# Altium schematic sheet PM12_P5V5.SchDoc: FIT_PM12 board
size 420 x 297 mm; CheckedBy: G.Kasprowicz; Author: INR Moscow; CompanyName: WUT ISE; DrawnBy: M.Podgórski; Organization: WUT ISE; Address1: PW ISE; Address2: Nowowiejska 15/19 00-665 Warsaw; Address3: gkasprow@gmail.com; DocumentNumber: 18; Revision: 2; SheetNumber: 19; SheetTotal: 34; ModifiedBy: -; CheckedDate: -; Title2: P5V5 PSU; DivGrp: WUT ISE; Designer: INR RAS; ModifiedDate: -; ProjectName: Sensor Box
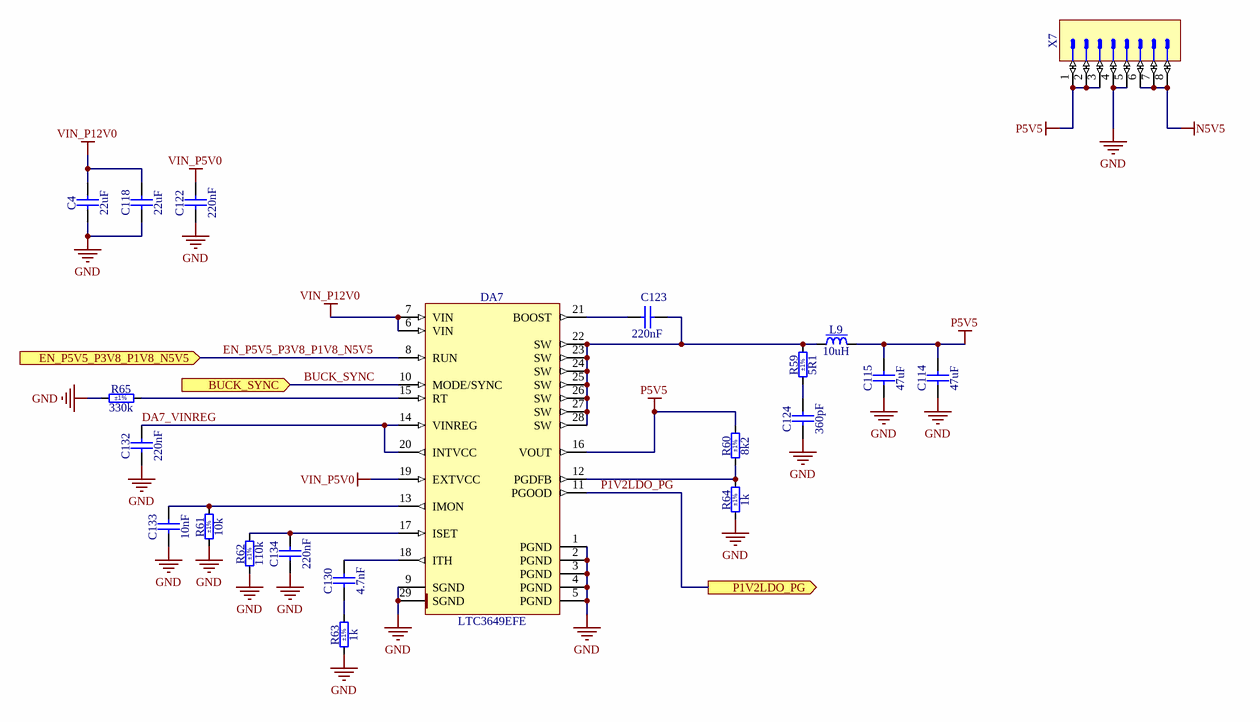
[diagram p0: PM12_P5V5.SchDoc]

## Parts
C4  22uF  [CAPC3216X180N]
C114  47uF  [CAPC3225X270N]
C115  47uF  [CAPC3225X270N]
C118  22uF  [CAPC3216X180N]
C122  220nF  [CAPC2012X135N]
C123  220nF  [CAPC2012X135N]
C124  360pF  [CAPC2013X145N]
C130  4.7nF  [CAPC2012X135N]
C132  220nF  [CAPC2012X135N]
C133  10nF  [CAPC2012X135N]
C134  220nF  [CAPC2012X135N]
DA7  LTC3649EFE  [SOP65P640X120-29N-R274X475]
L9  10uH  [IND_VISHAY_IHPL4040DZ-01]
R59  5R1  Tolerance: ±1%  [RESC2012X60N]
R60  8k2  Tolerance: ±1%  [RESC2012X60N]
R61  10k  Tolerance: ±1%  [RESC2012X60N]
R62  110k  Tolerance: ±1%  [RESC2012X60N]
R63  1k  Tolerance: ±1%  [RESC2012X60N]
R64  1k  Tolerance: ±1%  [RESC2012X60N]
R65  330k  Tolerance: ±1%  [RESC2012X60N]
X7  Header 8  [SAMTEC_DW-08-09-L-S-470]  (value not drawn)

## Ports
BUCK_SYNC (in), EN_P5V5_P3V8_P1V8_N5V5 (in), P1V2LDO_PG (out)

## Nets
GND: C4.1 C114.1 C115.1 C118.1 C122.1 C124.1 C132.1 C133.1 C134.1 DA7.1(PGND) DA7.2(PGND) DA7.3(PGND) DA7.4(PGND) DA7.5(PGND) DA7.9(SGND) DA7.29(SGND) R61.1 R62.1 R63.1 R64.1 R65.1 X7.4 X7.5
N5V5: X7.6 X7.7 X7.8
P5V5: C114.2 C115.2 DA7.16(VOUT) L9.2 R60.2 X7.1 X7.2 X7.3
VIN_P5V0: C122.2 DA7.19(EXTVCC)
VIN_P12V0: C4.2 C118.2 DA7.6(VIN) DA7.7(VIN)
BUCK_SYNC: DA7.10(MODE/SYNC) ; port BUCK_SYNC
DA7_VINREG: C132.2 DA7.14(VINREG) DA7.20(INTVCC)
EN_P5V5_P3V8_P1V8_N5V5: DA7.8(RUN) ; port EN_P5V5_P3V8_P1V8_N5V5
P1V2LDO_PG: DA7.11(PGOOD) ; port P1V2LDO_PG
NetC123_1: C123.1 DA7.21(BOOST)
NetC123_2: C123.2 DA7.22(SW) DA7.23(SW) DA7.24(SW) DA7.25(SW) DA7.26(SW) DA7.27(SW) DA7.28(SW) L9.1 R59.2
NetC124_2: C124.2 R59.1
NetC130_1: C130.1 R63.2
NetC130_2: C130.2 DA7.18(ITH)
NetC133_2: C133.2 DA7.13(IMON) R61.2
NetC134_2: C134.2 DA7.17(ISET) R62.2
NetDA7_12: DA7.12(PGDFB) R60.1 R64.2
NetDA7_15: DA7.15(RT) R65.2

## Notes on the sheet
- Project/Equipment
- Document
- Designer
- Drawn by
- Check.by
- Copyright WUT ISE 2024.
  This documentation describes Open Hardware and is licensed under the CERN OHL v.2. You may redistribute and modify this documentation under the terms of the CERN OHL v.2. (http://ohwr.org/CERNOHL). This documentation is distributed WITHOUT ANY EXPRESS OR IMPLIED WARRANTY, INCLUDING OF MERCHANTABILITY, SATISFACTORY QUALITY AND FITNESS FOR A PARTICULAR PURPOSE. Please see the CERN OHL v.2 for applicable conditions.
- Contact
- File
- Last Mod.
- Print Date
- Sheet
- Size
- A3
- of
- Rev

## Library data of the parts
C4 C118 = CC1206_22UF_25V_20%_X5R: Non-polarised capacitor; Part Description: SMD Multilayer Chip Ceramic Capacitor; Manufacturer: GENERIC; Manufacturer1 Part Number: C3216X5R1E226M160; Voltage: 25V; TC: X5R; Tolerance: ±20%; Part Number: CC1206_22UF_25V_20%_X5R; Component Kind: Standard; Component Type: Standard; Pin Count: 2; Value: 22uF; Status: None; Manufacturer Part Number: CC1206_22UF_25V_20%_X5R; Case: 1206; Mounted: Yes; Socket: No; SMD: Yes; Sense: No; Manufacturer1 Example: TDK; Manufacturer1 ComponentHeight: 1.8mm; HelpURL: \\cern.ch\dfs\Applications\Altium\Datasheets\CC1206_X5R_TDK_C.pdf; Author: CERN DEM WB; CreateDate: 25.07.2018; LatestRevisionDate: 25.07.2018
C114 C115 = CC1210_47UF_16V_20%_X5R: Non-polarised capacitor; Part Description: SMD Multilayer Chip Ceramic Capacitor; Manufacturer: GENERIC; Manufacturer1 Part Number: EMK325BJ476MM-T; Voltage: 16V; TC: X5R; Tolerance: ±20%; Part Number: CC1210_47UF_16V_20%_X5R; Component Kind: Standard; Component Type: Standard; Pin Count: 2; Value: 47uF; Status: None; Manufacturer Part Number: CC1210_47UF_16V_20%_X5R; Case: 1210; Mounted: Yes; Socket: No; SMD: Yes; Sense: No; Manufacturer1 Example: TAIYO YUDEN; Manufacturer1 ComponentHeight: 2.7mm; HelpURL: \\cern.ch\dfs\Applications\Altium\Datasheets\CC1210_X5R_TAIYO-YUDEN_HIGH-VALUE.pdf; Author: CERN DEM MR; CreateDate: 03.02.2016; LatestRevisionDate: 03.02.2016
C122 C123 C132 C134 = CC0805_220NF_50V_10%_X7R: Non-polarised capacitor; Part Description: SMD Multilayer Chip Ceramic Capacitor; Manufacturer: GENERIC; Manufacturer1 Part Number: GRM21BR71H224KA01L; Voltage: 50V; TC: X7R; Tolerance: ±10%; Part Number: CC0805_220NF_50V_10%_X7R; Component Kind: Standard; Component Type: Standard; Pin Count: 2; Value: 220nF; Status: Preferred; Manufacturer Part Number: CC0805_220NF_50V_10%_X7R; Case: 0805; Mounted: Yes; Socket: No; SMD: Yes; Sense: No; Manufacturer1 Example: MURATA; Manufacturer1 ComponentHeight: 1.35mm; HelpURL: \\cern.ch\dfs\Applications\Altium\Datasheets\CC0805_X7R_MURATA.pdf; Author: CERN DEM JLC; CreateDate: 03.12.2007; LatestRevisionDate: 03.12.2007
C124 = CC0805_360PF_50V_5%_C0G: Non-polarised capacitor; Part Description: SMD Multilayer Chip Ceramic Capacitor; Manufacturer: GENERIC; Manufacturer1 Part Number: CC0805JRNPO9BN361; Voltage: 50V; TC: NP0; Tolerance: ±5%; Part Number: CC0805_360PF_50V_5%_C0G; Component Kind: Standard; Component Type: Standard; Pin Count: 2; Value: 360pF; Status: None; Manufacturer Part Number: CC0805_360PF_50V_5%_C0G; Case: 0805; Mounted: Yes; Socket: No; SMD: Yes; Sense: No; Manufacturer1 Example: YAGEO PHYCOMP; Manufacturer1 ComponentHeight: 1.45mm; HelpURL: \\cern.ch\dfs\Applications\Altium\Datasheets\CC0805_NP0_YAGEO.pdf; Author: CERN DEM HF; CreateDate: 30.05.2024; LatestRevisionDate: 30.05.2024
C130 = CC0805_4.7NF_50V_10%_X7R: Non-polarised capacitor; Part Description: SMD Multilayer Chip Ceramic Capacitor; Manufacturer: GENERIC; Manufacturer1 Part Number: 223858615632; Voltage: 50V; TC: X7R; Tolerance: ±10%; Part Number: CC0805_4.7NF_50V_10%_X7R; Component Kind: Standard; Component Type: Standard; Pin Count: 2; Value: 4.7nF; Status: Preferred; Manufacturer Part Number: CC0805_4.7NF_50V_10%_X7R; Case: 0805; Mounted: Yes; Socket: No; SMD: Yes; Sense: No; Manufacturer1 Example: PHYCOMP; Manufacturer1 ComponentHeight: 0.94mm; HelpURL: \\cern.ch\dfs\Applications\Altium\Datasheets\CC0805_X7R_PHYCOMP.pdf; Author: CERN DEM JLC; CreateDate: 03.12.2007; LatestRevisionDate: 03.12.2007
C133 = CC0805_10NF_50V_10%_X7R: Non-polarised capacitor; Part Description: SMD Multilayer Chip Ceramic Capacitor; Manufacturer: GENERIC; Manufacturer1 Part Number: C0805C103K5RACTU; Voltage: 50V; TC: X7R; Tolerance: ±10%; Part Number: CC0805_10NF_50V_10%_X7R; Component Kind: Standard; Component Type: Standard; Pin Count: 2; Value: 10nF; Status: Preferred; Manufacturer Part Number: CC0805_10NF_50V_10%_X7R; Case: 0805; Mounted: Yes; Socket: No; SMD: Yes; Sense: No; Manufacturer1 Example: KEMET; Manufacturer1 ComponentHeight: 0.88mm; HelpURL: \\cern.ch\dfs\Applications\Altium\Datasheets\CC0805_X7R_KEMET.pdf; Author: CERN DEM JLC; CreateDate: 03.12.2007; LatestRevisionDate: 22.04.2015
DA7 = LTC3649EFE: 60V, 4A Synchronous Step-Down Regulator with Rail-to-Rail Programmable Output; Manufacturer: LINEAR TECHNOLOGY; PressFit: No; Bonding: No; Part Number: LTC3649EFE; Component Kind: Standard; Component Type: Standard; Device: LTC3649EFE; PackageDescription: SOP, 0.65mm pitch; 28 pin, 4.50mm W X 9.70mm L (thermal tab 4.75 X 2.74mm), IPC Medium Density; Part Description: 60V, 4A Synchronous Step-Down Regulator with Rail-to-Rail Programmable Output; Manufacturer Part Number: LTC3649EFE; Pin Count: 29; Case: SOP28; Mounted: Yes; Socket: No; SMD: Yes; Sense: No; ComponentHeight: 1.2mm; HelpURL: \\cern.ch\dfs\Applications\Altium\Datasheets\LTC3649.pdf; Author: CERN DEM HF; CreateDate: 05.06.2024; LatestRevisionDate: 05.06.2024
L9 = IND4040_10UH_20%_VISHAY_IHLP-4040DZ-01: Inductor With Core; Part Description: IHLP® Commercial Inductor, Low DCR Series; Manufacturer: VISHAY DALE; Manufacturer Part Number: IHLP4040DZER100M01; Power: 6.8A; Resistance: 0.0332R; Tolerance: ±20%; Part Number: IND4040_10UH_20%_VISHAY_IHLP-4040DZ-01; Component Kind: Standard; Component Type: Standard; Pin Count: 2; Value: 10uH; Case: 4040; Mounted: Yes; Socket: No; SMD: Yes; Sense: No; ComponentHeight: 4mm; HelpURL: \\cern.ch\dfs\Applications\Altium\Datasheets\IND_VISHAY_IHLP4040DZ-01.pdf; Author: CERN DEM HF; CreateDate: 31.05.2024; LatestRevisionDate: 31.05.2024
R59 = R0805_5R1_1%_0.125W_100PPM: Resistor - 1%; Part Description: Thick Film Chip Resistor; Manufacturer: GENERIC; Manufacturer1 Part Number: CRCW08055R10FKEAHP; Power: 0.125W; TC: ±100ppm/°C; PressFit: No; Part Number: R0805_5R1_1%_0.125W_100PPM; Component Kind: Standard; Component Type: Standard; Pin Count: 2; Value: 5R1; Status: None; Manufacturer Part Number: R0805_5R1_1%_0.125W_100PPM; Case: 0805; Mounted: Yes; Sense: No; Socket: No; SMD: Yes; Manufacturer1 Example: VISHAY; Manufacturer1 ComponentHeight: 0.6mm; HelpURL: \\cern.ch\dfs\Applications\Altium\Datasheets\R0805_VISHAY_CRCW-HP e3.pdf; Author: CERN DEM HF; CreateDate: 07.06.2024; LatestRevisionDate: 07.06.2024
R60 = R0805_8K2_1%_0.125W_100PPM: Resistor - 1%; Part Description: General Purpose Thick Film Chip Resistor; Manufacturer: GENERIC; Manufacturer1 Part Number: NRC10F8201TRF; Power: 0.125W; TC: ±100ppm/°C; PressFit: No; Part Number: R0805_8K2_1%_0.125W_100PPM; Component Kind: Standard; Component Type: Standard; Pin Count: 2; Value: 8k2; Status: Preferred; Manufacturer Part Number: R0805_8K2_1%_0.125W_100PPM; Case: 0805; Mounted: Yes; Sense: No; Socket: No; SMD: Yes; Manufacturer1 Example: NIC COMPONENT; Manufacturer1 ComponentHeight: 0.6mm; HelpURL: \\cern.ch\dfs\Applications\Altium\Datasheets\R0805_NIC_NRC.pdf; Author: CERN DEM JLC; CreateDate: 03.12.2007; LatestRevisionDate: 13.03.2008
R61 = R0805_10K_1%_0.125W_100PPM: Resistor - 1%; Part Description: General Purpose Thick Film Chip Resistor; Manufacturer: GENERIC; Manufacturer1 Part Number: NRC10F1002TRF; Power: 0.125W; TC: ±100ppm/°C; PressFit: No; Part Number: R0805_10K_1%_0.125W_100PPM; Component Kind: Standard; Component Type: Standard; Pin Count: 2; Value: 10k; Status: Preferred; Manufacturer Part Number: R0805_10K_1%_0.125W_100PPM; Case: 0805; Mounted: Yes; Sense: No; Socket: No; SMD: Yes; Manufacturer1 Example: NIC COMPONENT; Manufacturer1 ComponentHeight: 0.6mm; HelpURL: \\cern.ch\dfs\Applications\Altium\Datasheets\R0805_NIC_NRC.pdf; Author: CERN DEM JLC; CreateDate: 03.12.2007; LatestRevisionDate: 13.03.2008
R62 = R0805_110K_1%_0.125W_100PPM: Resistor - 1%; Part Description: General Purpose Thick Film Chip Resistor; Manufacturer: GENERIC; Manufacturer1 Part Number: NRC10F1103TRF; Power: 0.125W; TC: ±100ppm/°C; PressFit: No; Part Number: R0805_110K_1%_0.125W_100PPM; Component Kind: Standard; Component Type: Standard; Pin Count: 2; Value: 110k; Status: Preferred; Manufacturer Part Number: R0805_110K_1%_0.125W_100PPM; Case: 0805; Mounted: Yes; Sense: No; Socket: No; SMD: Yes; Manufacturer1 Example: NIC COMPONENT; Manufacturer1 ComponentHeight: 0.6mm; HelpURL: \\cern.ch\dfs\Applications\Altium\Datasheets\R0805_NIC_NRC.pdf; Author: CERN DEM JLC; CreateDate: 03.12.2007; LatestRevisionDate: 13.03.2008
R63 R64 = R0805_1K_1%_0.125W_100PPM: Resistor - 1%; Part Description: General Purpose Thick Film Chip Resistor; Manufacturer: GENERIC; Manufacturer1 Part Number: NRC10F1001TRF; Power: 0.125W; TC: ±100ppm/°C; PressFit: No; Part Number: R0805_1K_1%_0.125W_100PPM; Component Kind: Standard; Component Type: Standard; Pin Count: 2; Value: 1k; Status: Preferred; Manufacturer Part Number: R0805_1K_1%_0.125W_100PPM; Case: 0805; Mounted: Yes; Sense: No; Socket: No; SMD: Yes; Manufacturer1 Example: NIC COMPONENT; Manufacturer1 ComponentHeight: 0.6mm; HelpURL: \\cern.ch\dfs\Applications\Altium\Datasheets\R0805_NIC_NRC.pdf; Author: CERN DEM JLC; CreateDate: 03.12.2007; LatestRevisionDate: 13.03.2008
R65 = R0805_330K_1%_0.125W_100PPM: Resistor - 1%; Part Description: General Purpose Thick Film Chip Resistor; Manufacturer: GENERIC; Manufacturer1 Part Number: NRC10F3303TRF; Power: 0.125W; TC: ±100ppm/°C; PressFit: No; Part Number: R0805_330K_1%_0.125W_100PPM; Component Kind: Standard; Component Type: Standard; Pin Count: 2; Value: 330k; Status: Preferred; Manufacturer Part Number: R0805_330K_1%_0.125W_100PPM; Case: 0805; Mounted: Yes; Sense: No; Socket: No; SMD: Yes; Manufacturer1 Example: NIC COMPONENT; Manufacturer1 ComponentHeight: 0.6mm; HelpURL: \\cern.ch\dfs\Applications\Altium\Datasheets\R0805_NIC_NRC.pdf; Author: CERN DEM JLC; CreateDate: 03.12.2007; LatestRevisionDate: 13.03.2008
X7 = SAMTEC_DW-08-09-L-S-470: Connector 8 Male; Part Description: 8 Contacts, Pitch 2.54mm, Single Row Straight .Flex Stack, Flexible Board Stacker (Stacker Height = 11,938mm); Manufacturer: SAMTEC; PressFit: No; Part Number: SAMTEC_DW-08-09-L-S-470; Component Kind: Standard; Component Type: Standard; Pin Count: 8; Family: Header 8; Mounted: Yes; Socket: No; SMD: No; Sense: No; Status: None; Manufacturer Part Number: DW-08-09-L-S-470; ComponentHeight: 15.75mm; HelpURL: \\cern.ch\dfs\Applications\Altium\Datasheets\SAMTEC_DW.pdf; Author: CERN DEM HF; CreateDate: 06.06.2024; LatestRevisionDate: 06.06.2024